# Altium schematic sheet 3-Axis_Accelerometer.SchDoc: 3-Axis Accelerometer
size A4; Organization: Altium Limited.; Class: Sensor; MaxASupply: 3V6; MinASupply: 2V16; MaxDSupply: VDD + 0V1; MinDSupply: 1V71
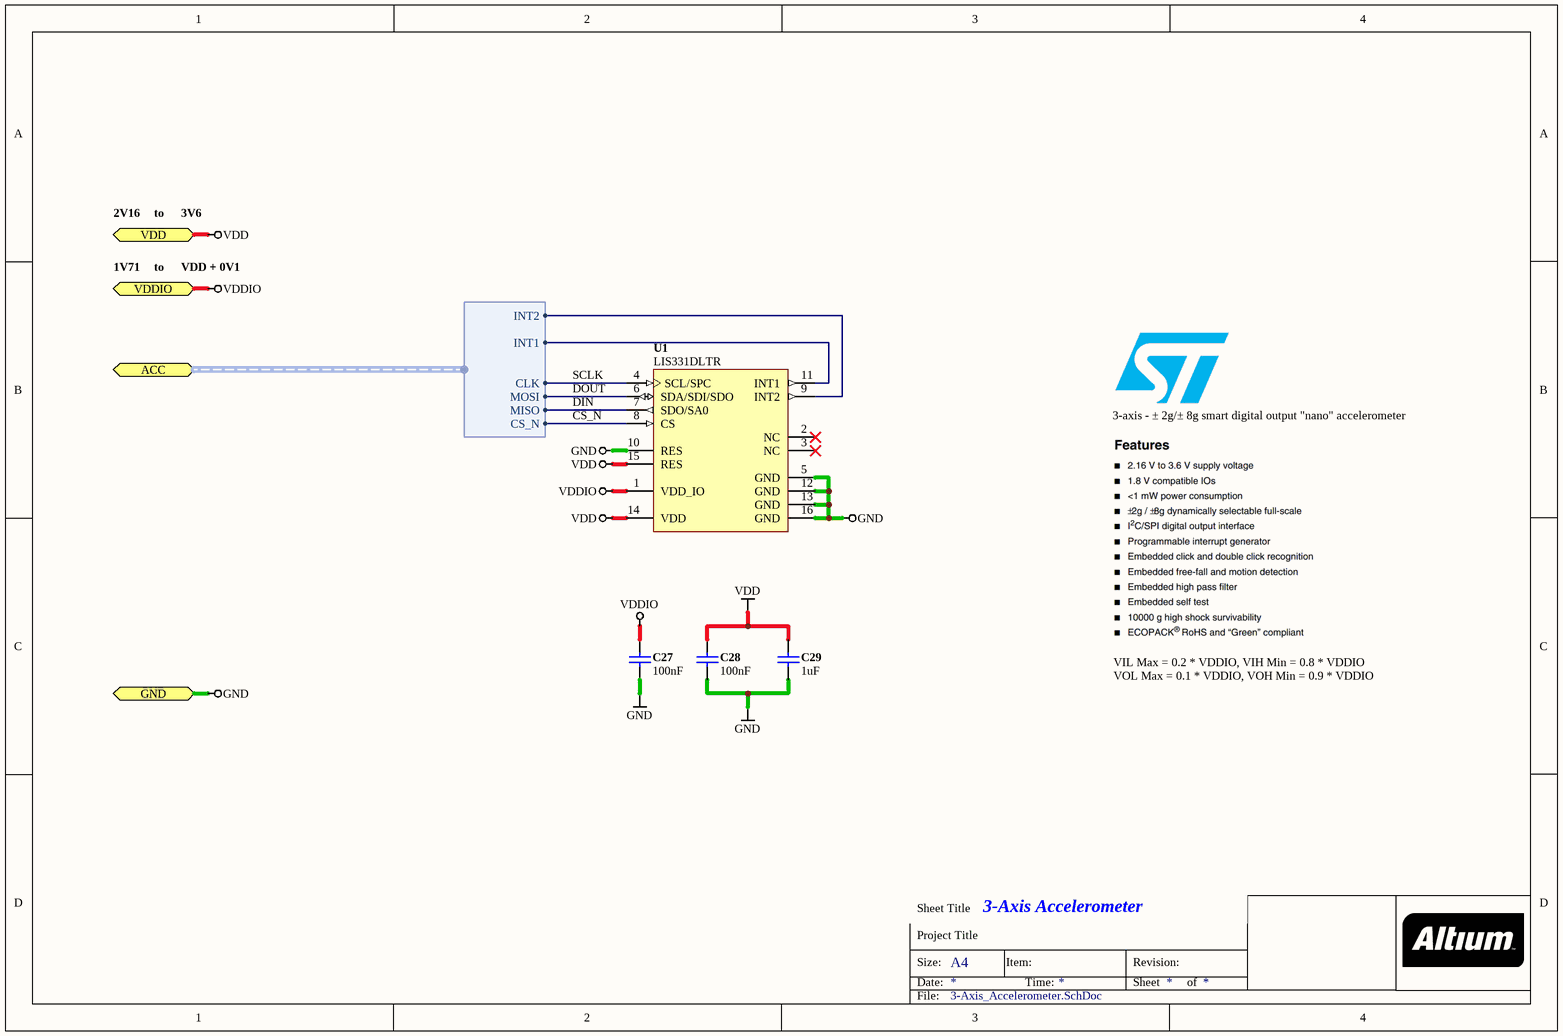
[diagram p0: 3-Axis_Accelerometer.SchDoc]

## Parts
C27  value 100nF  [CAPC0402(1005)60_N]  (hidden comment: CAP 100nF 16V 0402(1005))
C28  value 100nF  [CAPC0402(1005)60_N]  (hidden comment: CAP 100nF 16V 0402(1005))
C29  value 1uF  [CAPC0402(1005)60_N]  (hidden comment: CAP 1uF 16V 0402(1005))
U1  LIS331DLTR  [LGA16-3X3X1_L]

## Ports
ACC (harness SPI_LIS331), GND, VDD, VDDIO

## Harnesses
SPI_LIS331: CLK, CS_N, MOSI, MISO, INT1, INT2

## Nets
GND: C27.2 C28.1 C29.2 U1.5(GND) U1.10(RES) U1.12(GND) U1.13(GND) U1.16(GND) ; port GND
VDD: C28.2 C29.1 U1.14(VDD) U1.15(RES) ; port VDD
VDDIO: C27.1 U1.1(VDD_IO) ; port VDDIO
CS_N: U1.8(CS) ; port ACC.CS_N
DIN: U1.7(SDO/SA0) ; port ACC.MISO
DOUT: U1.6(SDA/SDI/SDO) ; port ACC.MOSI
SCLK: U1.4(SCL/SPC) ; port ACC.CLK
NetU1_9: U1.9(INT2) ; port ACC.INT2
NetU1_11: U1.11(INT1) ; port ACC.INT1

Not connected (* = marked no-connect by the designer): U1 2(NC)* 3(NC)*

## Notes on the sheet
- to
- 3-axis - ± 2g/± 8g smart digital output "nano" accelerometer
- VIL Max = 0.2 * VDDIO, VIH Min = 0.8 * VDDIO
  VOL Max = 0.1 * VDDIO, VOH Min = 0.9 * VDDIO
- Sheet Title
- Project Title
- Size:
- Date:
- A4
- Item:
- Time:
- Revision:
- Sheet
- of
- File:

## Library data of the parts
C27 C28 = CMP-1034-02069-1: CAP 100nF 16V ?0% 0402 (1005 Metric) Thickness 0.6mm SMD; Case-EIA: 0402; Case-Metric: 1005; Max Thickness: 0.6 mm; Tolerance: ?0%; Rated Voltage: 16 V; Technology: SMT
C29 = CMP-1034-02119-1: CAP 1uF 16V ?0% 0402 (1005 Metric) Thickness 0.6mm SMD; Case-EIA: 0402; Case-Metric: 1005; Technology: SMT; Rated Voltage: 16 V; Tolerance: ?0%; Max Thickness: 0.6 mm
U1 = CMP-0234-00061-2: MEMS motion sensor 3-axis - ± 2g/± 8g smart digital output nano accelerometer, -40 to +85°C, LGA-16 (3x3x1), Tape and Reel; Manufacturer: STMicroelectronics; ComponentLink3URL: http://www.st.com/internet/analog/product/191236.jsp; PackageVersion: 2008; ComponentLink2Description: LIS331DL Datasheet; ComponentLink1Description: Manufacturer URL; ComponentLink2URL: http://www.st.com/internet/com/TECHNICAL_RESOURCES/TECHNICAL_LITERATURE/DATASHEET/CD00172345.pdf; RevisionNote: PCB layout corrected.; PackageDescription: 16-Pin Land Grid Array, 3 x 3 x 1 mm Body, 0.5 mm Pitch; DatasheetVersion: rev3, Apr-2008; ComponentLink3Description: LIS331DL Web Page; PackageReference: LGA16-3X3X1; ComponentLink1URL: http://www.st.com/